# EAGLE design raupino (EAGLE 6.1)
Raupino is an arduino clone designed for battery and nrf applications
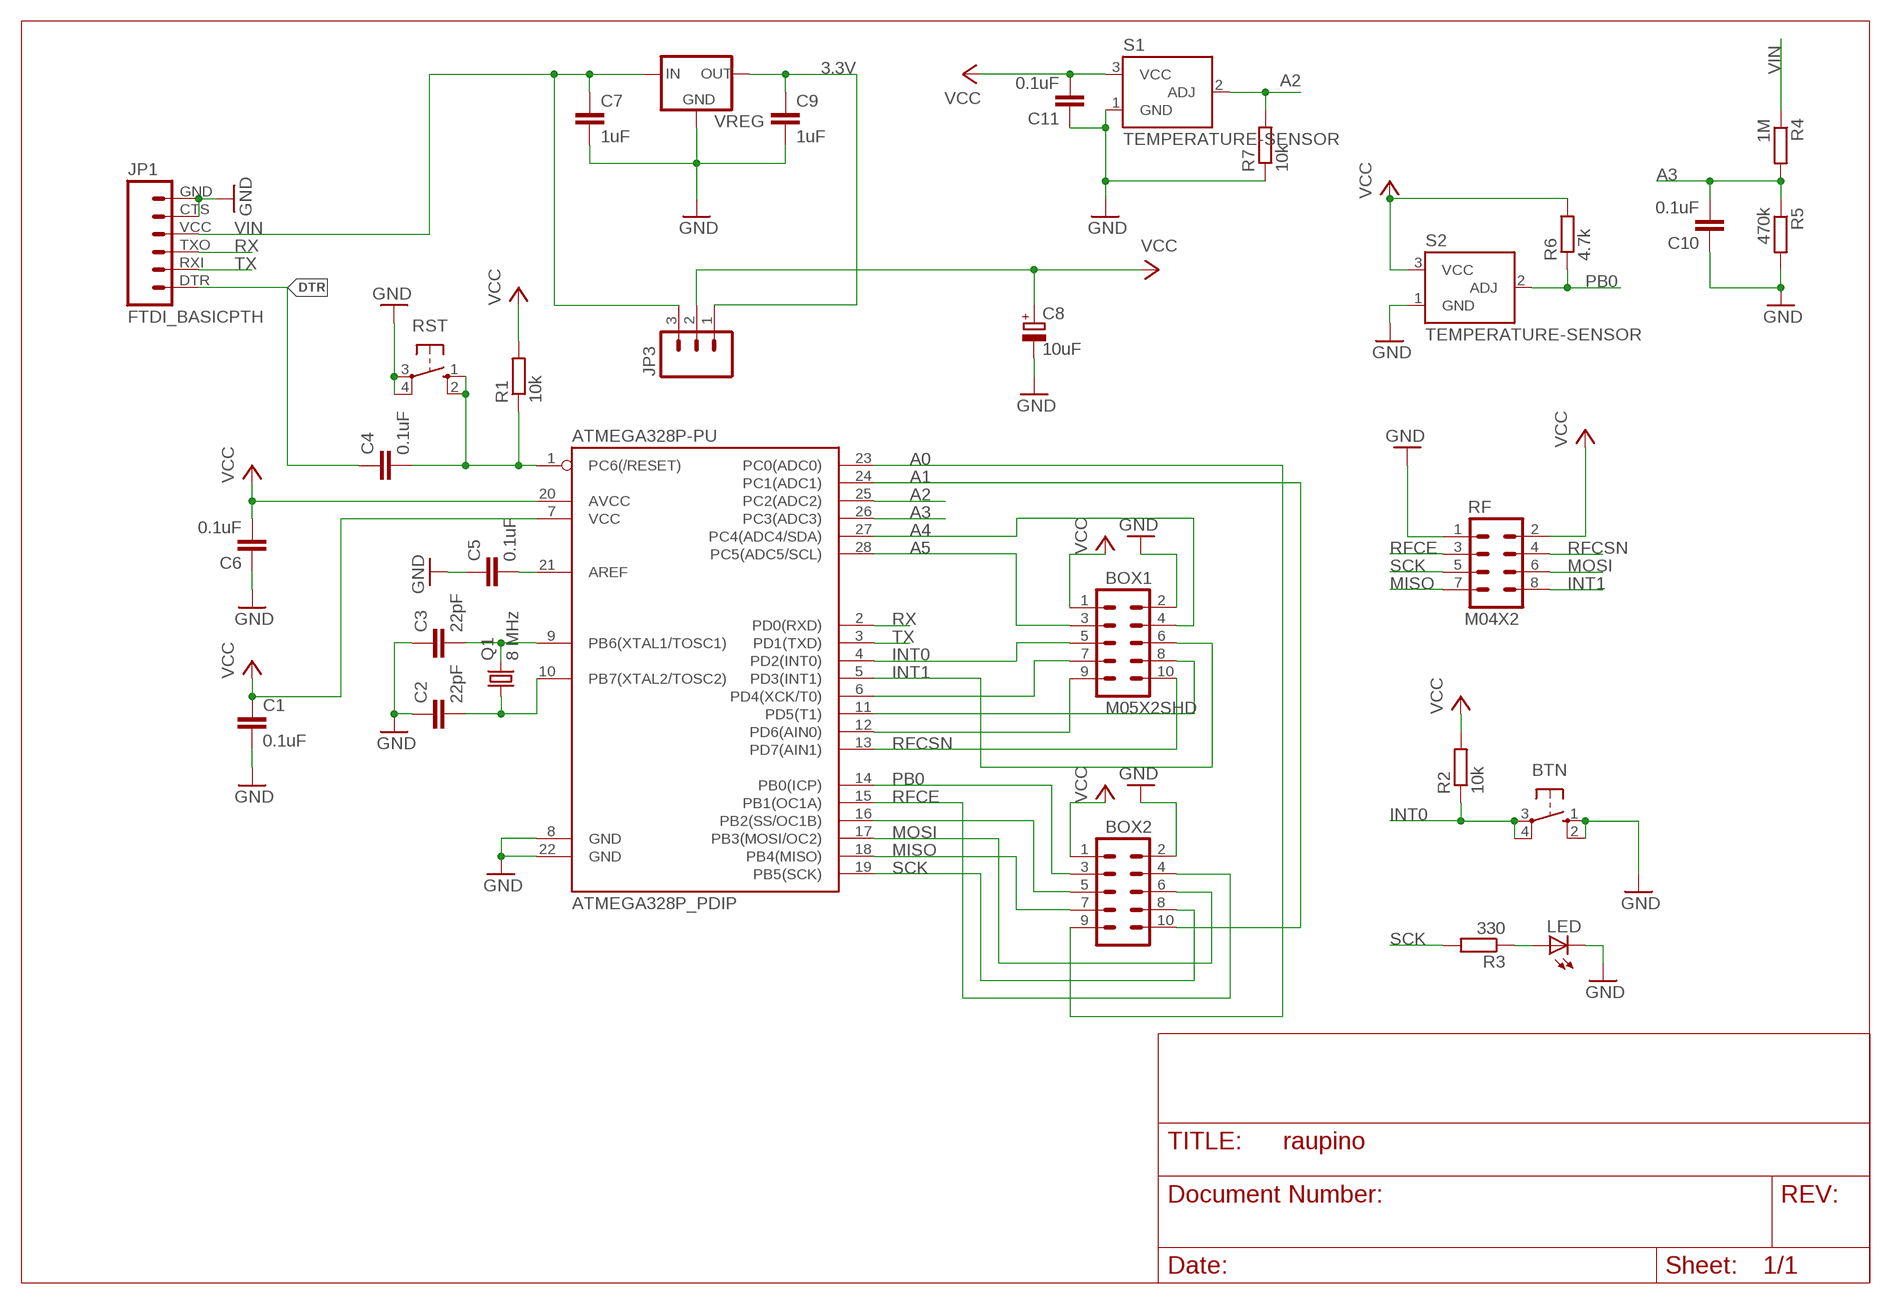
[diagram p0: schematic, sheet 1]

## Parts
ATMEGA328P-PU  ATMEGA328P_PDIP  [DIL28-3]
BOX1  M05X2SHD  [2X5-SHROUDED]
BOX2  M05X2SHD  [2X5-SHROUDED]
BTN  10-XX  [B3F-10XX]
C1  0.1uF  C-EUC0805  [C0805]
C2  22pF  C-EUC0805  [C0805]
C3  22pF  C-EUC0805  [C0805]
C4  0.1uF  C-EUC0805  [C0805]
C5  0.1uF  C-EUC0805  [C0805]
C6  0.1uF  C-EUC0805  [C0805]
C7  1uF  C-EU050-025X075  [C050-025X075]
C8  10uF  CPOL-EUTT2D5L  [TT2D5L]
C9  1uF  C-EU050-025X075  [C050-025X075]
C10  0.1uF  C-EUC0805  [C0805]
C11  0.1uF  C-EUC0805  [C0805]
JP1  FTDI_BASICPTH  [FTDI_BASIC]
JP3  M03PTH  [1X03]
LED  LED3MM  [LED3MM]
Q1  8 MHz  CRYSTALHC49US  [HC49US]
R1  10k  R-EU_R0805  [R0805]
R2  10k  R-EU_R0805  [R0805]
R3  330  R-EU_R0805  [R0805]
R4  1M  R-EU_R0805  [R0805]
R5  470k  R-EU_R0805  [R0805]
R6  4.7k  R-EU_R0805  [R0805]
R7  10k  R-EU_R0805  [R0805]
RF  M04X2  [2X4]
RST  10-XX  [B3F-10XX]
S1  TEMPERATURE-SENSOR  [TO-92]
S2  TEMPERATURE-SENSOR  [TO-92]
VREG  78LXX  [78LXX]

## Nets
3.3V [supply]: C9.1 JP3.1 VREG.OUT
A0: ATMEGA328P-PU.23(PC0(ADC0)) BOX2.9
A1: ATMEGA328P-PU.24(PC1(ADC1)) BOX2.10
A2: ATMEGA328P-PU.25(PC2(ADC2)) R7.2 S1.2(ADJ)
A3: ATMEGA328P-PU.26(PC3(ADC3)) C10.2 R4.2 R5.1
A4: ATMEGA328P-PU.27(PC4(ADC4/SDA)) BOX1.4
A5: ATMEGA328P-PU.28(PC5(ADC5/SCL)) BOX1.3
DTR: C4.1 JP1.DTR
GND: ATMEGA328P-PU.8(GND) ATMEGA328P-PU.22(GND) BOX1.2 BOX2.2 BTN.1(S) BTN.2(S1) C1.2 C2.1 C3.1 C5.1 C6.1 C7.2 C8.- C9.2 C10.1 C11.1 JP1.CTS JP1.GND LED.K(C) R5.2 R7.1 RF.1 RST.3(P) RST.4(P1) S1.1(GND) S2.1(GND) VREG.GND
INT0: ATMEGA328P-PU.4(PD2(INT0)) BOX1.5 BTN.3(P) BTN.4(P1) R2.1
INT1: ATMEGA328P-PU.5(PD3(INT1)) BOX1.6 RF.8
MISO: ATMEGA328P-PU.18(PB4(MISO)) BOX2.7 RF.7
MOSI: ATMEGA328P-PU.17(PB3(MOSI/OC2)) BOX2.6 RF.6
N$1: ATMEGA328P-PU.10(PB7(XTAL2/TOSC2)) C2.2 Q1.1
N$3: ATMEGA328P-PU.1(PC6(/RESET)) C4.2 R1.1 RST.1(S) RST.2(S1)
N$5: ATMEGA328P-PU.11(PD5(T1)) BOX1.8
N$6: ATMEGA328P-PU.9(PB6(XTAL1/TOSC1)) C3.2 Q1.2
N$7: ATMEGA328P-PU.12(PD6(AIN0)) BOX1.9
N$9: ATMEGA328P-PU.21(AREF) C5.2
N$10: LED.A R3.1
N$11: ATMEGA328P-PU.6(PD4(XCK/T0)) BOX1.7
N$15: ATMEGA328P-PU.16(PB2(SS/OC1B)) BOX2.5
PB0: ATMEGA328P-PU.14(PB0(ICP)) BOX2.3 R6.1 S2.2(ADJ)
RFCE: ATMEGA328P-PU.15(PB1(OC1A)) BOX2.4 RF.3
RFCSN: ATMEGA328P-PU.13(PD7(AIN1)) BOX1.10 RF.4
RX: ATMEGA328P-PU.2(PD0(RXD)) JP1.TXO
SCK: ATMEGA328P-PU.19(PB5(SCK)) BOX2.8 R3.2 RF.5
TX: ATMEGA328P-PU.3(PD1(TXD)) JP1.RXI
VCC [supply]: ATMEGA328P-PU.7(VCC) ATMEGA328P-PU.20(AVCC) BOX1.1 BOX2.1 C1.1 C6.2 C8.+ C11.2 JP3.2 R1.2 R2.2 R6.2 RF.2 S1.3(VCC) S2.3(VCC)
VIN [supply]: C7.1 JP1.VCC JP3.3 R4.1 VREG.IN

## Library data of the parts
ATMEGA328P-PU = SparkFun-DigitalIC:ATMEGA328P_PDIP: uC used in the Arduino 32kb flash, 1k EEPROM, 2k SRAM This is the through-hole version of this chip.
BOX1 BOX2 = SparkFun-Connectors:M05X2: Header 5x2 Standard 10-pin dual row 0.1" header. Commonly used with AVR-ISP. Use with Spark Fun Electronics SKU: PRT-00778
BTN RST = switch-omron:10-XX: OMRON SWITCH; MPN: B3F-1000; OC_FARNELL: 176432; OC_NEWARK: 36M3542
C1-C7 C9-C11 = rcl:C-EU: CAPACITOR, European symbol
C8 = rcl:CPOL-EU: POLARIZED CAPACITOR, European symbol
JP1 = SparkFun-Connectors:FTDI_BASIC: FTDI Basic header with labels
JP3 = SparkFun-Connectors:M03: Header 3 Standard 3-pin 0.1" header. Use with straight break away headers (SKU : PRT-00116), right angle break away headers (PRT-00553), swiss pins (PRT-00743), machine pins (PRT-00117), and female headers (PRT-00115). Molex polarized connector foot print use with SKU : PRT-08232 with associated crimp pins and housings.
LED = led:LED: LED OSRAM: - CHIPLED LG R971, LG N971, LY N971, LG Q971, LY Q971, LO R971, LY R971 LH N974, LH R974 LS Q976, LO Q976, LY Q976 LO Q996 - Hyper CHIPLED LW Q18S LB Q993, LB Q99A, LB R99A - SideLED LS A670, LO A670, LY A670, LG A670, LP A670 LB A673, LV A673, LT A673, LW A673 LH A674 LY A675 LS A676, LA A676, LO A676, LY A676, LW A676 LS A679, LY A679, LG A679 - Hyper Micro SIDELED® LS Y876, LA Y876, LO Y876, LY Y876 LT Y87S - SmartLED LW L88C, LW L88S LB L89C, LB L89S, LG L890 LS L89K, LO L89K, LY L89K LS L896, LA L896, LO L896, LY L896 - TOPLED LS T670, LO T670, LY T670, LG T670, LP T670 LSG T670, LSP T670, LSY T670, LOP T670, LYG T670 LG T671, LOG T671, LSG T671 LB T673, LV T673, LT T673, LW T673 LH T674 LS T676, LA T676, LO T676, LY T676, LB T676, LH T676, LSB T676, LW T676 LB T67C, LV T67C, LT T67C, LS T67K, LO T67K, LY T67K, LW E67C LS E67B, LA E67B, LO E67B, LY E67B, LB E67C, LV E67C, LT E67C LW T67C LS T679, LY T679, LG T679 LS T770, LO T770, LY T770, LG T770, LP T770 LB T773, LV T773, LT T773, LW T773 LH T774 LS E675, LA E675, LY E675, LS T675 LS T776, LA T776, LO T776, LY T776, LB T776 LHGB T686 LT T68C, LB T68C - Hyper Mini TOPLED® LB M676 - Mini TOPLED Santana® LG M470 LS M47K, LO M47K, LY M47K Source: http://www.osram.convergy.de LUXEON: - LUMILED® LXK2-PW12-R00, LXK2-PW12-S00, LXK2-PW14-U00, LXK2-PW14-V00 LXK2-PM12-R00, LXK2-PM12-S00, LXK2-PM14-U00 LXK2-PE12-Q00, LXK2-PE12-R00, LXK2-PE12-S00, LXK2-PE14-T00, LXK2-PE14-U00 LXK2-PB12-K00, LXK2-PB12-L00, LXK2-PB12-M00, LXK2-PB14-N00, LXK2-PB14-P00, LXK2-PB14-Q00 LXK2-PR12-L00, LXK2-PR12-M00, LXK2-PR14-Q00, LXK2-PR14-R00 LXK2-PD12-Q00, LXK2-PD12-R00, LXK2-PD12-S00 LXK2-PH12-R00, LXK2-PH12-S00 LXK2-PL12-P00, LXK2-PL12-Q00, LXK2-PL12-R00 Source: www.luxeon.com KINGBRIGHT: KA-3528ASYC Source: www.kingbright.com
Q1 = SparkFun-FreqCtrl:CRYSTAL: Various standard crystals. Proven footprints. Spark Fun Electronics SKU : COM-00534
R1-R7 = rcl:R-EU_: RESISTOR, European symbol
RF = SparkFun-Connectors:M04X2: .1" header, two rows of four.
S1 S2 = SparkFun-Sensors:TEMPERATURE-SENSOR: TO-92 temp sensor
VREG = v-reg:78LXX: VOLTAGE REGULATOR

## Net classes
0 default: width 0.305 mm
1 supply: width 0.305 mm

## Board
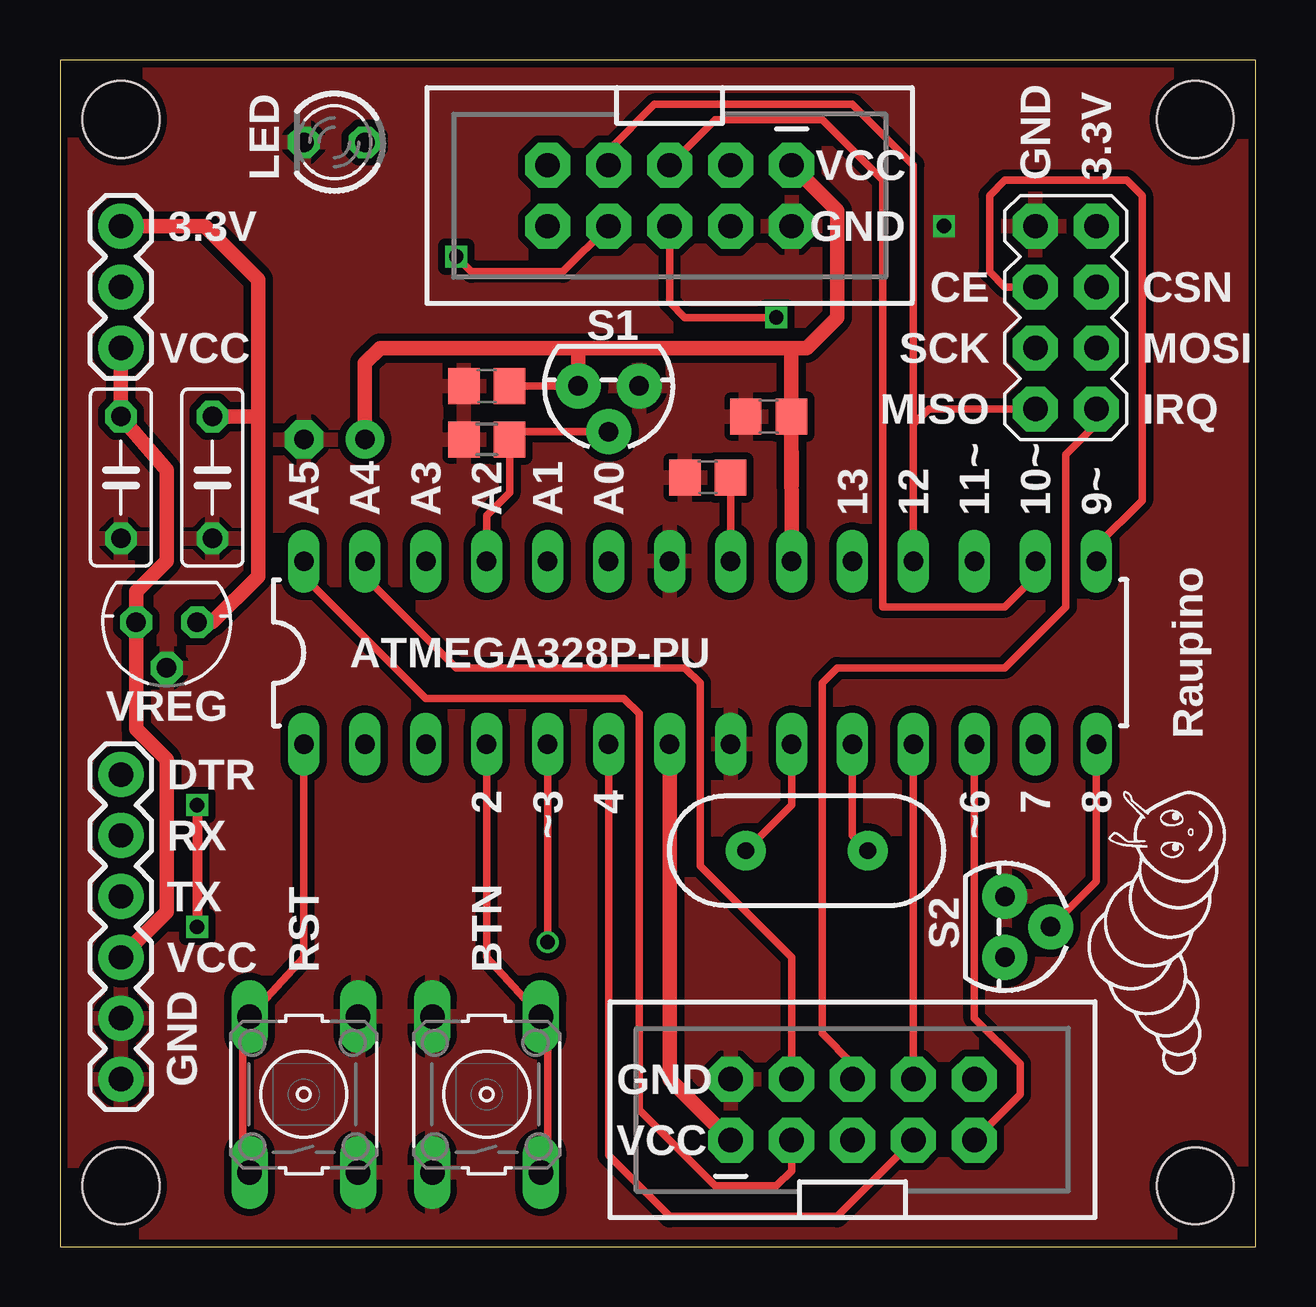
[diagram p1: board, top side]
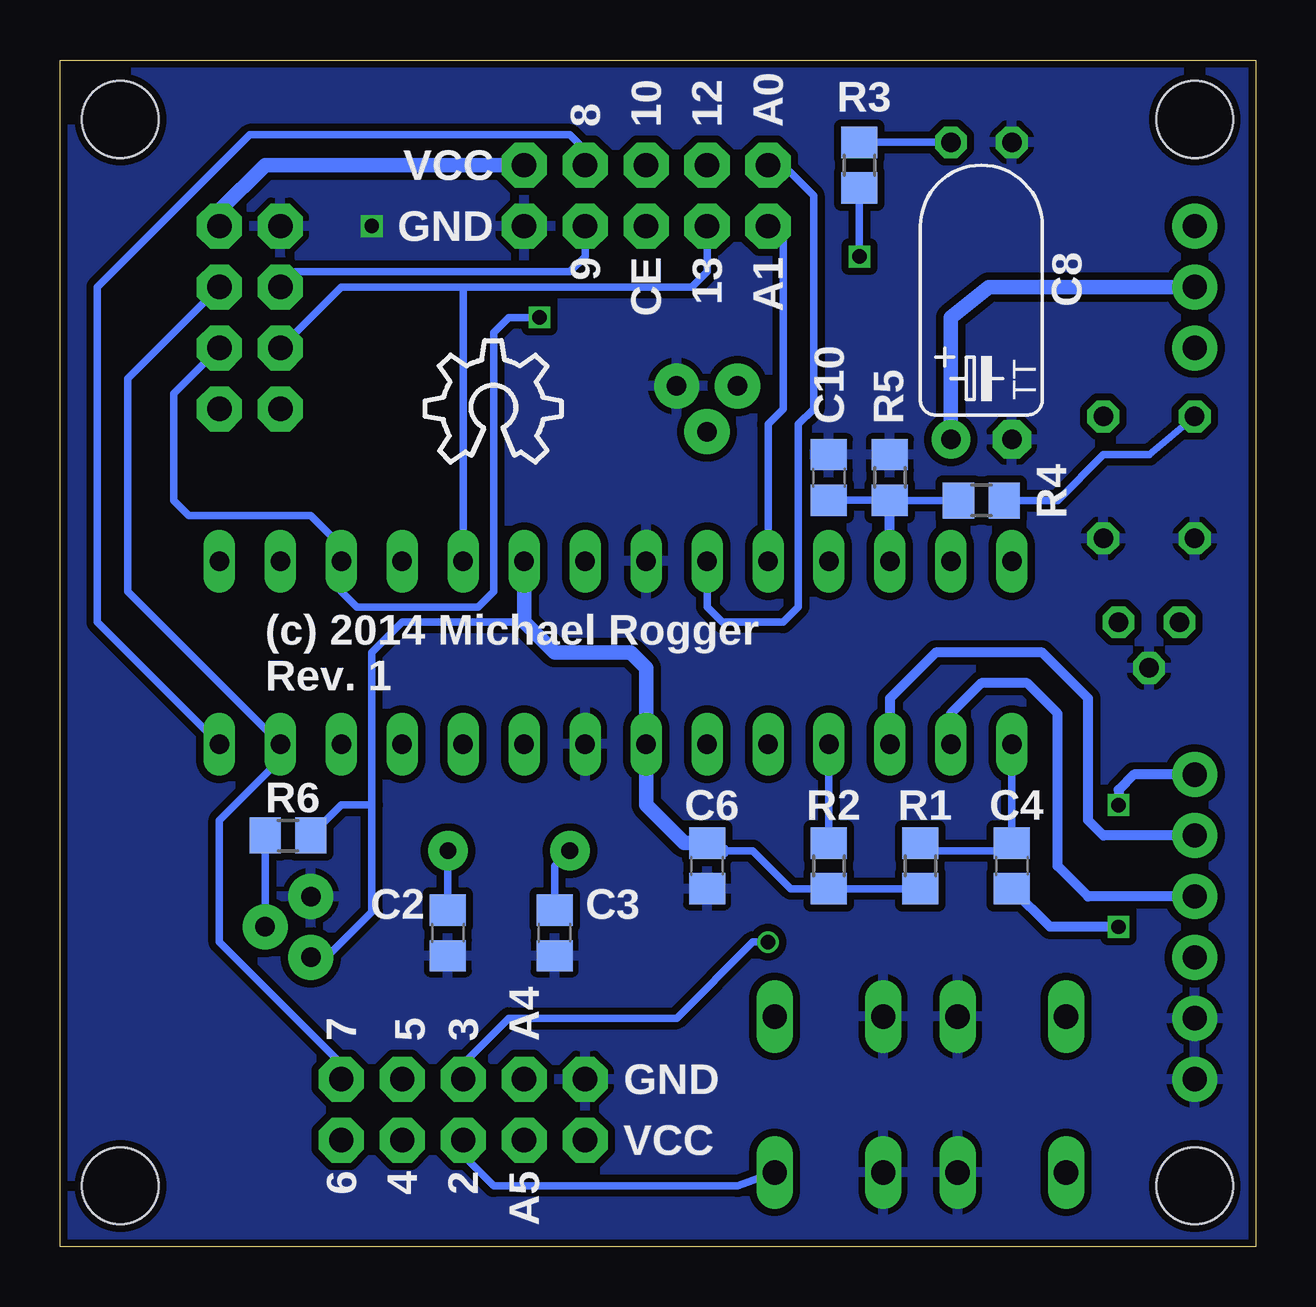
[diagram p2: board, bottom side, seen from below]

Size 49.82 x 49.47 mm. Coordinates in mm from the lower left corner, seen from the top.
Outline: 0,0 49.82,0 49.82,49.47 0,49.47 0,0
Copper layers (1*16): Top 0.035mm / dielectric 1.5mm / Bottom 0.035mm
Design rules: minimum track width 6mil, minimum drill 0.3mm, track to track 6mil, track to pad 6mil, pad to pad 6mil, via to via 6mil, smd to smd 0mil, copper to edge 6mil, drill to drill 6mil, minimum pad ring 10mil, minimum via ring 6mil, stop-mask expansion 2mil, vias tented up to drill 100mil, thermal gap 10mil
Holes 3.2 mm at 47.31,46.99 47.31,2.54 2.54,2.54 2.54,46.99

### Footprints (pad centres in the part's own frame; a part is rotated, then mirrored left to right if it is on the bottom)
DIL28-3 = drill 0.813 long: 1 -16.51,-3.81; 2 -13.97,-3.81; 3 -11.43,-3.81; 4 -8.89,-3.81; 5 -6.35,-3.81; 6 -3.81,-3.81; 7 -1.27,-3.81; 8 1.27,-3.81; 9 3.81,-3.81; 10 6.35,-3.81; 11 8.89,-3.81; 12 11.43,-3.81; 13 13.97,-3.81; 14 16.51,-3.81; 15 16.51,3.81; 16 13.97,3.81; 17 11.43,3.81; 18 8.89,3.81; 19 6.35,3.81; 20 3.81,3.81; 21 1.27,3.81; 22 -1.27,3.81; 23 -3.81,3.81; 24 -6.35,3.81; 25 -8.89,3.81; 26 -11.43,3.81; 27 -13.97,3.81; 28 -16.51,3.81
2X5-SHROUDED = drill 1.016 pad 1.88 octagon: 1 -1.27,5.08; 2 1.27,5.08; 3 -1.27,2.54; 4 1.27,2.54; 5 -1.27,0; 6 1.27,0; 7 -1.27,-2.54; 8 1.27,-2.54; 9 -1.27,-5.08; 10 1.27,-5.08
B3F-10XX = drill 1.016 long: 1 -3.251,2.261; 2 3.251,2.261; 3 -3.251,-2.261; 4 3.251,-2.261
C0805 = smd 1.3 x 1.5: 1 -0.95,0; 2 0.95,0
C050-025X075 = drill 0.813 octagon: 1 -2.54,0; 2 2.54,0
TT2D5L = drill 0.813 pad 1.6: + -1.27,0 | drill 0.813 pad 1.6 octagon: - 1.27,0
FTDI_BASIC = drill 1.016 pad 1.88: CTS 10.16,0; DTR 0,0; GND 12.7,0; RXI 2.54,0; TXO 5.08,0; VCC 7.62,0
1X03 = drill 1.016 pad 1.88: 1 0,0; 2 2.54,0; 3 5.08,0
LED3MM = drill 0.813 octagon: A -1.27,0; K 1.27,0
HC49US = drill 0.7 pad 1.651: 1 -2.54,0; 2 2.54,0
R0805 = smd 1.3 x 1.5: 1 -0.95,0; 2 0.95,0
2X4 = drill 1.016 pad 1.88 octagon: 1 -3.81,-1.27; 2 -3.81,1.27; 3 -1.27,-1.27; 4 -1.27,1.27; 5 1.27,-1.27; 6 1.27,1.27; 7 3.81,-1.27; 8 3.81,1.27
TO-92 = drill 0.813 pad 1.88: 1 -1.27,0; 2 0,1.905; 3 1.27,0
78LXX = drill 0.813 octagon: GND 0,1.905; IN 1.27,0; OUT -1.27,0

### Placement (x,y rotation side)
ATMEGA328P-PU  26.67,24.77 0 top
BOX1  33.02,5.71 90 top
BOX2  25.4,43.81 270 top
BTN  17.78,6.35 90 top
C1  29.53,34.61 180 top
C2  33.66,13.08 90 bottom
C3  29.21,13.08 90 bottom
C4  10.16,15.88 90 bottom
C5  26.99,32.07 0 top
C6  22.86,15.88 90 bottom
C7  2.54,32.07 270 top
C8  11.43,33.66 0 bottom
C9  6.35,32.07 270 top
C10  17.78,32.07 270 bottom
C11  17.78,35.88 0 top
JP1  2.54,19.68 270 top
JP3  2.54,42.55 270 top
LED  11.43,46.04 180 top
Q1  31.11,16.51 180 top
R1  13.97,15.88 270 bottom
R2  17.78,15.88 270 bottom
R3  16.51,45.09 270 bottom
R4  11.43,31.11 180 bottom
R5  15.24,32.07 90 bottom
R6  40.32,17.14 0 bottom
R7  17.78,33.66 0 top
RF  41.91,38.73 270 top
RST  10.16,6.35 90 top
S1  22.86,35.88 180 top
S2  39.37,13.34 270 top
U$1  [OSHW_8X200_NOTEXT]  34.61,32.7 0 bottom
VREG  4.45,26.04 180 top

### Tracks (layer width: path | path; a pad name or v marks a point on that pad's centre or on a via)
3.3V
  Top 0.61: 8.26,34.61 8.26,27.94 6.35,26.04 VREG.OUT | 8.26,34.61 8.26,40.32 6.03,42.55 JP3.1 | 8.26,34.61 C9.1
A0
  Bottom 0.305: BOX2.9 19.68,45.09 18.41,43.81 18.41,34.92 19.05,34.29 19.05,31.75 19.05,26.67 19.68,26.04 22.23,26.04 22.86,26.67 ATMEGA328P-PU.23
A1
  Bottom 0.305: BOX2.10 19.68,41.91 19.68,34.92 20.32,34.29 ATMEGA328P-PU.24
A2
  Top 0.305: S1.2 19.36,33.97 R7.2 18.73,31.43 17.78,30.48 ATMEGA328P-PU.25
A3
  Bottom 0.305: C10.2 R5.1 R4.2
  Bottom 0.406: ATMEGA328P-PU.26 R5.1
A4
  Top 0.305: BOX1.4 30.48,12.06 26.67,15.88 26.67,23.5 26.04,24.13 16.51,24.13 12.7,27.94 ATMEGA328P-PU.27
A5
  Top 0.305: BOX1.3 30.48,3.17 29.84,2.54 27.3,2.54 24.13,5.71 24.13,22.23 23.5,22.86 15.24,22.86 10.16,27.94 ATMEGA328P-PU.28
DTR  (via drill 0.6)
  Top 0.406: v5.71,18.41 v5.71,13.34
  Bottom 0.406: JP1.DTR 5.08,19.68 5.71,19.05 v5.71,18.41 | v5.71,13.34 8.57,13.34 C4.1
GND  (via drill 0.6)
  other vias: 36.83,42.55
  pour Top (isolate 0.305): 0,49.53 0,0 50.16,0 50.16,49.53
  pour Bottom (isolate 0.305): 0,49.53 50.16,49.53 50.16,0 0,0
INT0
  Top 0.305: BTN.3 20.32,3.81 20.32,8.89 BTN.4 17.78,12.06 ATMEGA328P-PU.4
  Bottom 0.305: ATMEGA328P-PU.4 R2.1 17.78,16.51 | BOX1.5 33.02,3.81 31.75,2.54 21.59,2.54 BTN.3
INT1  (via drill 0.61)
  Top 0.305: RF.8 43.18,34.29 41.91,33.02 41.91,26.67 39.37,24.13 32.38,24.13 31.75,23.5 31.75,8.89 33.02,7.62 BOX1.6 | v20.32,12.7 ATMEGA328P-PU.5
  Bottom 0.305: BOX1.6 33.02,7.62 31.11,9.53 24.13,9.53 20.95,12.7 v20.32,12.7
MISO
  Top 0.305: 35.56,34.29 36.2,34.92 RF.7 | 35.56,34.29 ATMEGA328P-PU.18 | 35.56,34.29 35.56,45.09 33.02,47.62 24.77,47.62 22.86,45.72 BOX2.7
MOSI  (via drill 0.6)
  Top 0.305: v29.84,38.73 26.04,38.73 25.4,39.37 BOX2.6
  Bottom 0.305: RF.6 45.09,35.56 45.09,31.11 44.45,30.48 39.37,30.48 38.1,29.21 ATMEGA328P-PU.17 38.1,27.3 37.47,26.67 32.38,26.67 31.75,27.3 31.75,38.1 31.11,38.73 v29.84,38.73
N$1
  Top 0.305: ATMEGA328P-PU.10 33.02,17.14 Q1.1
  Bottom 0.305: C2.2 Q1.1
N$3
  Top 0.305: RST.1 7.62,3.81 7.62,8.89 RST.2 10.16,12.06 ATMEGA328P-PU.1
  Bottom 0.305: ATMEGA328P-PU.1 C4.2 10.16,16.51 13.97,16.51 R1.1
N$5
  Top 0.305: BOX1.8 ATMEGA328P-PU.11
N$6
  Top 0.305: ATMEGA328P-PU.9 30.48,18.41 Q1.2
  Bottom 0.305: C3.2 29.21,15.88 Q1.2
N$7
  Top 0.305: ATMEGA328P-PU.12 38.1,9.53 40.01,7.62 40.01,6.35 BOX1.9
N$9
  Top 0.305: ATMEGA328P-PU.21 C5.2 27.94,31.75
N$10
  Bottom 0.305: R3.1 14.61,46.03 LED.A
N$11
  Top 0.305: ATMEGA328P-PU.6 22.86,3.81 25.4,1.27 32.38,1.27 BOX1.7
N$15
  Top 0.305: BOX2.5 27.3,46.99 31.75,46.99 34.29,44.45 34.29,26.67 39.37,26.67 40.64,27.94 ATMEGA328P-PU.16
PB0
  Top 0.305: ATMEGA328P-PU.14 43.18,15.24 S2.2
  Bottom 0.305: ATMEGA328P-PU.14 48.26,26.04 48.26,40.01 41.91,46.35 28.57,46.35 27.94,45.72 BOX2.3 | R6.1 S2.2
RFCE
  Top 0.305: ATMEGA328P-PU.15 43.18,29.21 45.09,31.11 45.09,43.81 44.45,44.45 39.37,44.45 38.73,43.81 38.73,40.64 39.37,40.01 RF.3
  Bottom 0.305: BOX2.4 27.94,41.27 28.57,40.64 40.01,40.64 RF.3
RFCSN
  Bottom 0.305: BOX1.10 38.1,7.62 43.18,12.7 43.18,17.78 40.64,20.32 ATMEGA328P-PU.13 46.99,27.3 46.99,36.2 RF.4
RX
  Bottom 0.406: JP1.TXO 6.99,14.61 8.26,15.88 8.26,22.23 9.53,23.5 11.43,23.5 12.7,22.23 ATMEGA328P-PU.2
SCK  (via drill 0.6)
  Top 0.305: BOX2.8 20.95,40.64 17.14,40.64 v16.51,41.27
  Bottom 0.305: 33.02,40.01 ATMEGA328P-PU.19 | 33.02,40.01 38.1,40.01 RF.5 | 33.02,40.01 23.5,40.01 22.86,40.64 BOX2.8 | R3.2 v16.51,41.27
TX
  Bottom 0.406: JP1.RXI 6.35,17.14 6.99,17.78 6.99,22.86 8.89,24.77 13.34,24.77 15.24,22.86 ATMEGA328P-PU.3
VCC
  Top 0.305: S1.3 21.59,36.2 | 21.59,36.2 21.59,37.47 | C11.2 21.27,35.88 21.59,36.2
  Top 0.61: ATMEGA328P-PU.20 C1.1 | 30.48,31.75 C1.1 | ATMEGA328P-PU.7 25.4,6.99 BOX1.1 | 21.59,37.47 30.48,37.47 | 30.48,37.47 31.11,37.47 32.38,38.73 32.38,43.18 BOX2.1 | 21.59,36.83 21.59,37.47 | C8.+ 12.7,36.83 13.34,37.47 21.59,37.47 | C1.1 30.48,37.46 30.48,37.47
  Bottom 0.305: R6.2 38.1,18.41 36.83,18.41 | S2.3 38.73,12.06 36.83,13.97 36.83,18.41 | 36.83,18.41 36.83,24.77 35.56,26.04 30.48,26.04 | 22.55,16.51 20.95,16.51 19.37,14.93 R2.2 R1.2
  Bottom 0.61: RF.2 43.18,43.18 41.27,45.09 BOX2.1 | ATMEGA328P-PU.20 30.48,26.04 29.21,24.77 26.04,24.77 25.4,24.13 ATMEGA328P-PU.7 25.4,18.41 23.81,16.82 C6.2 22.55,16.51 22.23,16.51 | R2.2 17.78,14.61 | JP3.2 11.11,40.01 12.7,38.73 C8.+
VIN
  Top 0.61: JP1.VCC 4.45,13.97 4.45,20.32 3.17,21.59 VREG.IN 3.17,27.3 4.45,28.57 4.45,32.38 C7.1 JP3.3
  Bottom 0.305: R4.1 8.26,31.11 6.35,33.02 4.45,33.02 C7.1

### Text on the board
tPlace: VCC | GND | 3.3V | 3.3V | GND | S1 | CE | CSN | VCC | SCK | MOSI | MISO | IRQ | A5 | A4 | A3 | A2 | A1 | A0 | 13 | 12 | 11~ | 10~ | 9~ | Raupino | DTR | 2 | ~3 | 4 | ~6 | 7 | 8 | RX | TX | S2 | VCC | GND | GND | VCC
bPlace: A0 | 12 | 10 | 8 | VCC | GND | A1 | 13 | CE | 9 | (c) 2014 Michael Rogger | Rev. 1 | A4 | 3 | 5 | 7 | GND | VCC | A5 | 2 | 4 | 6
mfgcode: XXXXXXXXXXXX